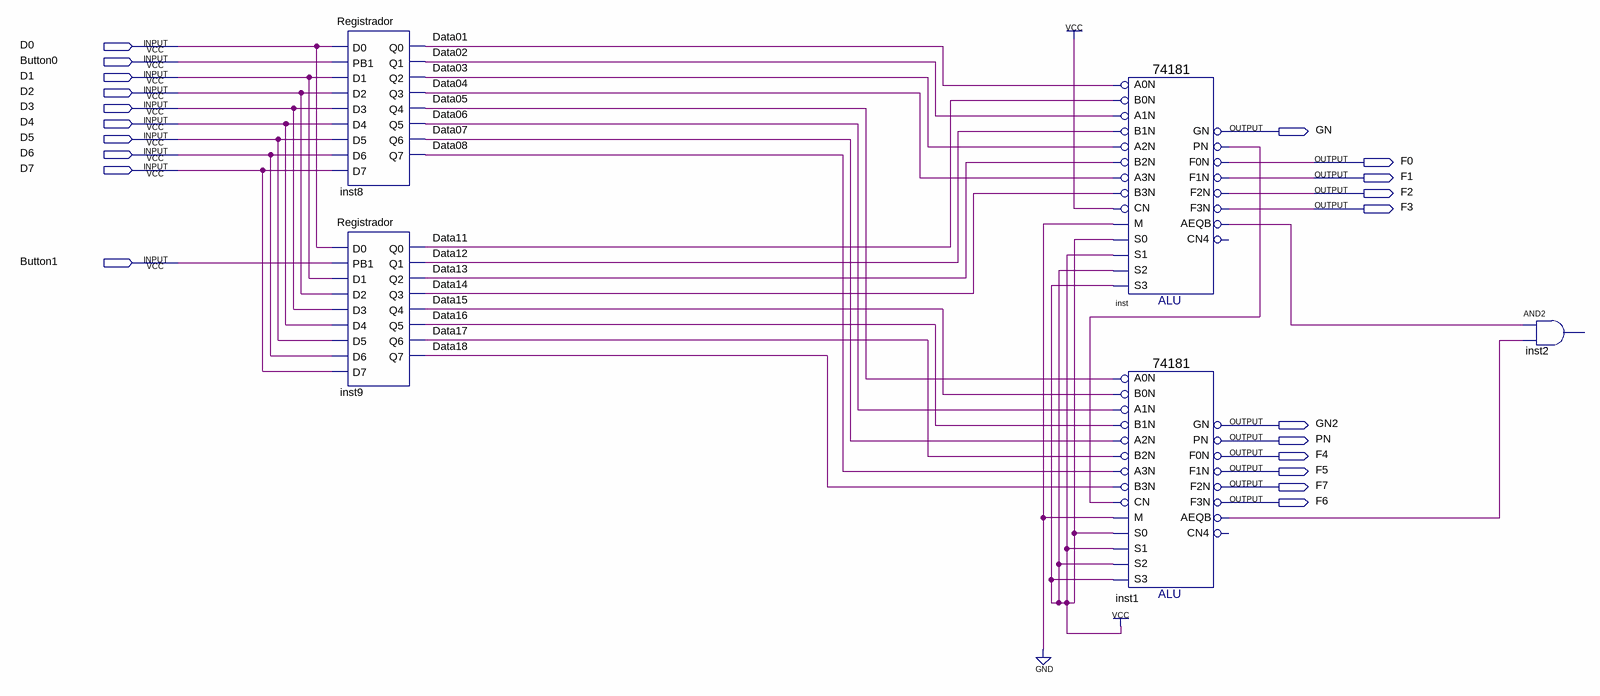
[diagram p0: schematic sheet]
// Quartus schematic AtividadeULA.bdf as structural Verilog: 5 symbols, 21 pins
module AtividadeULA (
  input  D0,
  input  Button0,
  input  D1,
  input  D2,
  input  D3,
  input  D4,
  input  D5,
  input  D6,
  input  D7,
  input  Button1,
  output GN,
  output F0,
  output F1,
  output F2,
  output F3,
  output GN2,
  output PN,
  output F4,
  output F5,
  output F7,
  output F6
);

  wire Data01, Data02, Data03, Data04, Data05, Data06, Data07, Data08, Data11, Data12, Data13, Data14,
       Data15, Data16, Data17, Data18, inst1_aeqb, inst_aeqb, inst_pn;

  Registrador inst8 (
    .D0(D0), .PB1(Button0), .D1(D1), .D2(D2), .D3(D3), .D4(D4), .D5(D5), .D6(D6), .D7(D7), .Q0(Data01),
    .Q1(Data02), .Q2(Data03), .Q3(Data04), .Q4(Data05), .Q5(Data06), .Q6(Data07), .Q7(Data08));
  Registrador inst9 (
    .D0(D0), .PB1(Button1), .D1(D1), .D2(D2), .D3(D3), .D4(D4), .D5(D5), .D6(D6), .D7(D7), .Q0(Data11),
    .Q1(Data12), .Q2(Data13), .Q3(Data14), .Q4(Data15), .Q5(Data16), .Q6(Data17), .Q7(Data18));
  \74181  inst (
    .B0N(Data11), .A0N(Data01), .A1N(Data02), .B1N(Data12), .A3N(Data04), .B2N(Data13), .A2N(Data03),
    .M(1'b0), .CN(1'b1), .B3N(Data14), .S2(1'b1), .S1(1'b1), .S0(1'b1), .S3(1'b1), .PN(inst_pn), .GN(GN),
    .F3N(F3), .F1N(F1), .F0N(F0), .AEQB(inst_aeqb), .F2N(F2));  // open: CN4
  \74181  inst1 (
    .B0N(Data15), .A0N(Data05), .A1N(Data06), .B1N(Data16), .A3N(Data08), .B2N(Data17), .A2N(Data07),
    .M(1'b0), .CN(inst_pn), .B3N(Data18), .S2(1'b1), .S1(1'b1), .S0(1'b1), .S3(1'b1), .PN(PN), .GN(GN2),
    .F3N(F6), .F1N(F5), .F0N(F4), .AEQB(inst1_aeqb), .F2N(F7));  // open: CN4
  // AND2 inst2 has open pins: IN1=inst_aeqb, IN2=inst1_aeqb, OUT=open
endmodule
